# Altium schematic sheet Sheet1.SchDoc
size A; SheetNumber: 1; SheetTotal: 1
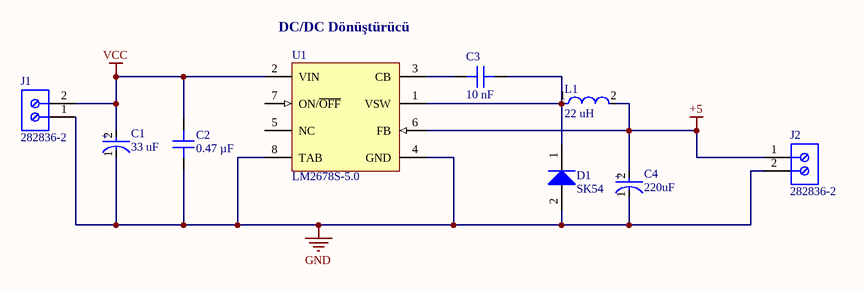
[diagram p0: Sheet1.SchDoc]

## Parts
C1  33 uF  [FP-FK-D-MFG]
C2  0.47 µF  [CAP 1206_3216 - 0.8MM]
C3  10 nF  [CAP 0805_2012]
C4  220uF  [FP-UWT1H101MNL1GS-MFG]
D1  SK54  [ONSC-SOD-323-2-477-02_V]
J1  282836-2  [TECO-282836-2_V]
J2  282836-2  [TECO-282836-2_V]
L1  22 uH  [FP-SRR1260-MFG]
U1  LM2678S-5.0  [KTW0007B_N]

## Nets
+5: C4.2(A) J2.1 L1.2 U1.6(FB)
GND: C1.1(C) C2.1 C4.1(C) D1.2(A) J1.1 J2.2 U1.4(GND) U1.8(TAB)
VCC: C1.2(A) C2.2 J1.2 U1.2(VIN)
NetC3_1: C3.1 U1.3(CB)
NetC3_2: C3.2 D1.1(K) L1.1 U1.1(VSW)

Not connected (* = marked no-connect by the designer): U1 5(NC) 7(ON/~{OFF})

## Notes on the sheet
- (near U1) DC/DC Dönüştürücü
- (in symbol CMP-2000-07373-2) +
- (in symbol CMP-05427-000002-1) +

## Library data of the parts
C1 = CMP-05427-000002-1: CAP ALUM 47UF 20% 35V SMD; Manufacturer: Panasonic; Manufacturer Part Number: EEE-FK1V470P; Life: 2000Hours; Leakage Current: 16.45uA; Automotive Grade: Grade 2; Esr: 0.36Ω; Ripple Current: 240mA; Material: Aluminum; Description: 47µF 35V Aluminum Electrolytic Capacitors Radial, Can - SMD 2000 Hrs @ 105°C; Dissipation Factor: 12%; Category: Cap; Device Class L3: Aluminum Electrolytic Capacitors; Value: 47uF; Device Class L2: Capacitors; ComponentLink2Description: Datasheet; Capacitance: 47uF; Temperature Range Low: -55°C; Device Class L1: Passive Components; Height: 6.1mm; Temperature Range High: +105°C; Lead Free: Yes; Octopart: https://octopart.com/eeefk1v470p-panasonic-4642848; Tolerance: 20%; Temperature: -55°C to +105°C; Voltage Rating: 35V; ComponentLink2URL: https://industrial.panasonic.com/cdbs/www-data/pdf/RDE0000/ABA0000C1181.pdf; Automotive: Yes; Mouser Description: Capacitor Aluminum Electrolytic 47uF 35 Volt 20% (6.3 X 5.8mm) Surface Mount 240mA 2000h 105C Automotive; RoHS: TRUE; Digikey Description: CAP ALUM 47UF 20% 35V SMD; Package: FK-D
C2 = CL31B474KBHNNNE: CAP CER 0.47UF 50V X7R 1206; manufacturer: Samsung Electro-Mechanics; Tolerance: ±10%; Part Number: CL31B474KBHNNNE; Value: 0.47 µF; Applications: General Purpose; Capacitance: 0.47 µF; componentlink1description: Datasheet; componentlink1url: http://www.samsungsem.com/kr/support/product-search/mlcc/CL31B474KBHNNNE.jsp; componentlink2description: DigiKey Link; componentlink2url: https://www.digikey.com/en/products/detail/samsung-electro-mechanics/CL31B474KBHNNNE/3886776; Device Package: 1206 (3216 Metric); lastupdated: 3/17/2022 8:31:11 AM; Lifecycle Status: Active; Minimum Order: 1; Mounting Type: Surface Mount, MLCC; Operating Temperature: -55°C ~ 125°C; Package / Case: 1206 (3216 Metric); packaging: TapeAndReel; partid: 20844; Part Status: Active; price: 0.02; series: CL; Size / Dimension: 0.126" L x 0.063" W (3.20mm x 1.60mm); Supplier 1: DigiKey; Supplier Part Number 1: 1276-1118-1-ND; Temperature Coefficient: X7R; Thickness (Max): 0.071" (1.80mm); Voltage - Rated: 50V
C3 = CL21B103KB6WPNC: CAP CER 10000PF 50V X7R 0805; manufacturer: Samsung Electro-Mechanics; Tolerance: ±10%; Part Number: CL21B103KB6WPNC; Value: 10 nF; Applications: Automotive; Capacitance: 10000 pF; componentlink1description: Datasheet; componentlink1url: http://www.samsungsem.com/kr/support/product-search/mlcc/CL21B103KB6WPNC.jsp; componentlink2description: DigiKey Link; componentlink2url: https://www.digikey.com/en/products/detail/samsung-electro-mechanics/CL21B103KB6WPNC/5961049; Device Package: 0805 (2012 Metric); Features: Open Mode; lastupdated: 3/17/2022 8:29:38 AM; Lifecycle Status: Active; Minimum Order: 1; Mounting Type: Surface Mount, MLCC; Operating Temperature: -55°C ~ 125°C; Package / Case: 0805 (2012 Metric); packaging: TapeAndReel; partid: 3767; Part Status: Active; price: 0.03; Ratings: AEC-Q200; series: CL; Size / Dimension: 0.079" L x 0.049" W (2.00mm x 1.25mm); Supplier 1: DigiKey; Supplier Part Number 1: 1276-6565-1-ND; Temperature Coefficient: X7R; Thickness (Max): 0.028" (0.70mm); Voltage - Rated: 50V
C4 = CMP-2000-07373-2: CAP ALUM 100UF 20% 50V SMD; Leakage Current: 3uA; Ripple Current: 140mA; Life (Hours): 1000Hour; Dissipation Factor: 0.14%; Dielectric Material: Aluminium; Termination: SMD/SMT; Tolerance: 20%; Package Quantity: 500; Capacitance: 100uF; Height: 10mm; REACH SVHC: No SVHC; Case/Package: Radial; Series: WT; Diameter: 8mm; Voltage Rating: 50V; Construction: Cylindrical; Length: 10mm; Min Operating Temperature: -55°C; Max Operating Temperature: 105°C; Voltage Rating (DC): 50V; Packaging: Tape and Reel; Voltage: 50V; Mount: Surface Mount; Ripple Current (AC): 140mA; Radiation Hardening: No; Number of Pins: 2; Lead Free: Lead Free; Height - Seated (Max): 0.413inch; RoHS Compliant: Yes
D1 = CMP-1055-00462-1: Schottky Barrier Diode, 2-Pin SOD-323, Pb-Free, Tape and Reel; PartNumber: BAT54HT1G; Manufacturer: On Semiconductor; Configuration: Single; trr Max (ns): 5; IFSM Max (A): 0.6; ComponentLink3URL: http://www.onsemi.com/pub_link/Collateral/477-02.PDF.1; PackageDescription: 2-Pin SOD, Body 1.7 x 1.25 mm; ComponentLink2URL: http://www.onsemi.cn/pub_link/Collateral/BAT54HT1-D.PDF; ComponentLink3Description: Package Specification; ComponentLink2Description: Datasheet; DatasheetVersion: Rev. 6; PackageReference: SOD-323-2-477-02; RoHS: TRUE; ComponentLink1URL: http://www.onsemi.com/; Packing: Tape and Reel; Mounting Technology: Surface Mount; ComponentLink1Description: Manufacturer URL; PackageVersion: Rev. H, 03/2007
J1 J2 = CMP-1684-00017-1: Female Header, Pitch 5 mm, 1 x 2 Position, Height 10 mm, Tail Length 3.5 mm, Rohs, Bulk; Manufacturer: TE Connectivity; Wire Gauge: 16-30AWG; Product Training Modules: Wire-to-BoardEurostyleTerminalBlocks; Clamp Material - Plating: Brass-NickelPlated; Voltage: 300V; Mating Orientation: HorizontalwithBoard; Current: 13.5A; Pitch: 0.197"(5.00mm); Screw Thread: M3; 3D Model: 282836-2.pdf; Other Names: 5ULV-02B / A98076; Dynamic Catalog: BuchananSeries; Number of Levels: 1; Torque - Screw: 0.68Nm(6Lb-In); Featured Product: EurostyleTerminalBlockConnectors; Positions Per Level: 2; Wire Termination: Screw-RisingCageClamp; Datasheet URL: http://www.te.com.cn/commerce/DocumentDelivery/DDEController?Action=showdoc&DocId=Catalog+Section%7F1308389_EUROSTYLE_TERMINAL_BLOCKS%7F0607%7Fpdf%7FEnglish%7FENG_CS_1308389_EUROSTYLE_TERMINAL_BLOCKS_0607.pdf%7F282836-2; Color: Green; Family: TerminalBlocks-WiretoBoard; RoHS Information: 282836-2StatementofCompliance; Standard Package: 300; Contact Material - Plating: Brass-TinPlated; Manufacturer URL: http://www.te.com; Housing Material: Polyamide(PA66),Nylon6/6; Features: Interlocking(Side); Package Description: Female Header, Pitch 5 mm, 1 x 2 Position, Height 10 mm, Tail Length 3.5 mm; Mounting Type: ThroughHole; Package Reference: THD; Packaging: Bulk; Series: Buchanan; Category: Connectors,Interconnects; Screw Material - Plating: Brass-NickelPlated
L1 = CMP-2000-07146-2: FIXED IND 15UH 5A 27 MOHM SMD; Q Factor: 25; Sample Rate (Hz): 100kHz; Resistance: 27MR; Material: Steel; Inductance Tolerance: 20%; Frequency: 17.6MHz; Saturation Current: 4.6A; Core Material: Ferrite; Shielding: Shielded; Series: SRR1260; Termination: SMD/SMT; Packaging: Tape and Reel; RoHS Compliant: Yes; Height - Seated (Max): 0.256inch; Depth: 12.8mm; Case/Package: 1260; Inductance: 15uH; Height: 6mm; Number of Pins: 2; Mount: Surface Mount; Min Operating Temperature: -40°C; Test Frequency: 100kHz; Length: 12.5mm; Self Resonant Frequency: 17.6MHz; Current Rating: 5A; Tolerance: 20%; RMS Current (Irms): 5A; REACH SVHC: No SVHC; Resistor Type: Wirewound; DC Resistance (DCR): 27mR; Width: 12.5mm; Package Quantity: 600; DC Current: 5A; Max DC Current: 5A; Max Operating Temperature: 125°C; Military Standard: Not
U1 = CMP-0069-00190-3: SIMPLE SWITCHER® High Efficiency 5A Step-Down Voltage Regulator, 7-pin TO-263; Manufacturer: Texas Instruments; PowerWise: N; PackageTopMarking: NSUZXYTTE#*LM2678*S-5.0; RoHS: N; PinCount: 7; Code_JEDEC: MO-169-AC; ComponentLink1URL: http://www.ti.com/general/docs/lit/getliterature.tsp?genericPartNumber=LM2678&fileType=pdf; ComponentLink1Description: Datasheet URL; PackageReference: KTW0007B; PackageDescription: TO-263, Molded, .400 x .390 x .180in Body, 7 Lead, .050in Pitch, Surface Mount; CompType: Switcher